# EAGLE design sub (EAGLE 9.6.1)
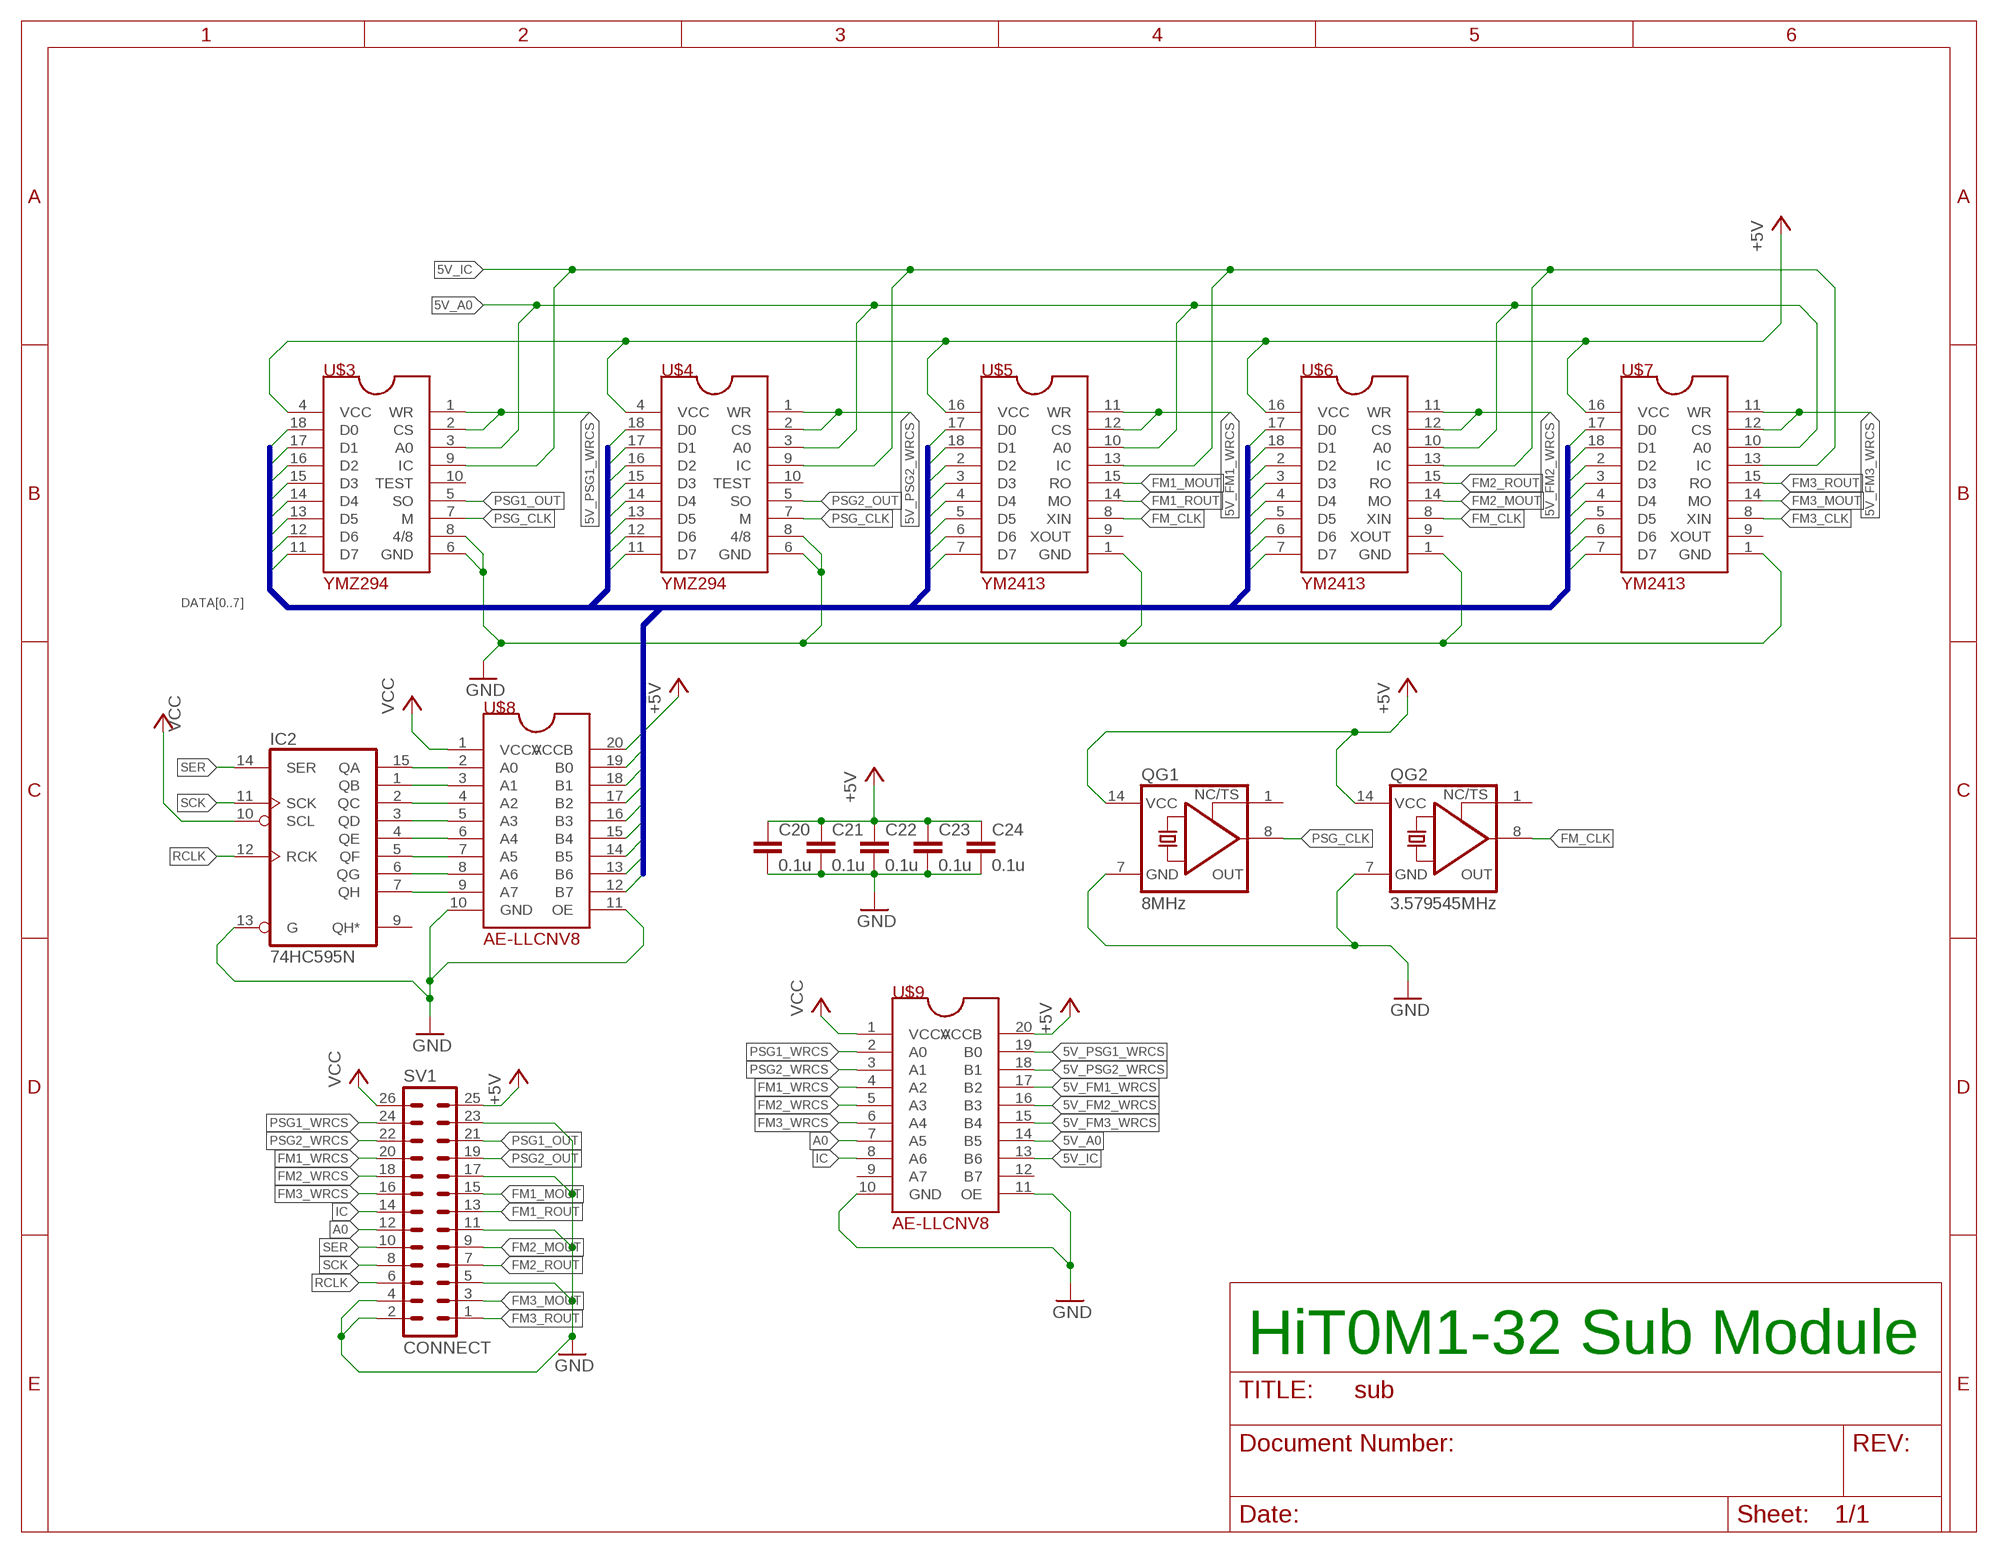
[diagram p0: schematic, sheet 1]

## Parts
C20  0.1u  C-EU025-025X050  [C025-025X050]
C21  0.1u  C-EU025-025X050  [C025-025X050]
C22  0.1u  C-EU025-025X050  [C025-025X050]
C23  0.1u  C-EU025-025X050  [C025-025X050]
C24  0.1u  C-EU025-025X050  [C025-025X050]
IC2  74HC595N  [DIL16]
QG1  8MHz  XO-14  [DIL14S]
QG2  3.579545MHz  XO-14  [DIL14S]
SV1  CONNECT  MA13-2  [MA13-2]
U$3  YMZ294  YMZ294YMZ294  [DIL18]
U$4  YMZ294  YMZ294YMZ294  [DIL18]
U$5  YM2413  [DIL18]
U$6  YM2413  [DIL18]
U$7  YM2413  [DIL18]
U$8  AE-LLCNV8  AE-LLCNV8AE-LLCNV8  [DIL20]
U$9  AE-LLCNV8  AE-LLCNV8AE-LLCNV8  [DIL20]

## Nets
5V_A0: U$3.3(A0) U$4.3(A0) U$5.10(A0) U$6.10(A0) U$7.10(A0) U$9.14(B5)
5V_FM1_WRCS: U$5.11(WR) U$5.12(CS) U$9.17(B2)
5V_FM2_WRCS: U$6.11(WR) U$6.12(CS) U$9.16(B3)
5V_FM3_WRCS: U$7.11(WR) U$7.12(CS) U$9.15(B4)
5V_IC: U$3.9(IC) U$4.9(IC) U$5.13(IC) U$6.13(IC) U$7.13(IC) U$9.13(B6)
5V_PSG1_WRCS: U$3.1(WR) U$3.2(CS) U$9.19(B0)
5V_PSG2_WRCS: U$4.1(WR) U$4.2(CS) U$9.18(B1)
+5V: C20.1 C21.1 C22.1 C23.1 C24.1 QG1.14(VCC) QG2.14(VCC) SV1.25 U$3.4(VCC) U$4.4(VCC) U$5.16(VCC) U$6.16(VCC) U$7.16(VCC) U$8.20(VCCB) U$9.20(VCCB)
A0: SV1.12 U$9.7(A5)
DATA0: U$3.18(D0) U$4.18(D0) U$5.17(D0) U$6.17(D0) U$7.17(D0) U$8.19(B0)
DATA1: U$3.17(D1) U$4.17(D1) U$5.18(D1) U$6.18(D1) U$7.18(D1) U$8.18(B1)
DATA2: U$3.16(D2) U$4.16(D2) U$5.2(D2) U$6.2(D2) U$7.2(D2) U$8.17(B2)
DATA3: U$3.15(D3) U$4.15(D3) U$5.3(D3) U$6.3(D3) U$7.3(D3) U$8.16(B3)
DATA4: U$3.14(D4) U$4.14(D4) U$5.4(D4) U$6.4(D4) U$7.4(D4) U$8.15(B4)
DATA5: U$3.13(D5) U$4.13(D5) U$5.5(D5) U$6.5(D5) U$7.5(D5) U$8.14(B5)
DATA6: U$3.12(D6) U$4.12(D6) U$5.6(D6) U$6.6(D6) U$7.6(D6) U$8.13(B6)
DATA7: U$3.11(D7) U$4.11(D7) U$5.7(D7) U$6.7(D7) U$7.7(D7) U$8.12(B7)
FM1_MOUT: SV1.15 U$5.15(RO)
FM1_ROUT: SV1.13 U$5.14(MO)
FM1_WRCS: SV1.20 U$9.4(A2)
FM2_MOUT: SV1.9 U$6.14(MO)
FM2_ROUT: SV1.7 U$6.15(RO)
FM2_WRCS: SV1.18 U$9.5(A3)
FM3_CLK: U$7.8(XIN)
FM3_MOUT: SV1.3 U$7.14(MO)
FM3_ROUT: SV1.1 U$7.15(RO)
FM3_WRCS: SV1.16 U$9.6(A4)
FM_CLK: QG2.8(OUT) U$5.8(XIN) U$6.8(XIN)
GND: C20.2 C21.2 C22.2 C23.2 C24.2 IC2.13(G) QG1.7(GND) QG2.7(GND) SV1.2 SV1.4 SV1.5 SV1.11 SV1.17 SV1.23 U$3.6(GND) U$3.8(4/8) U$4.6(GND) U$4.8(4/8) U$5.1(GND) U$6.1(GND) U$7.1(GND) U$8.10(GND) U$8.11(OE) U$9.10(GND) U$9.11(OE)
IC: SV1.14 U$9.8(A6)
N$2: IC2.15(QA) U$8.2(A0)
N$14: IC2.1(QB) U$8.3(A1)
N$17: IC2.2(QC) U$8.4(A2)
N$22: IC2.4(QE) U$8.6(A4)
N$27: IC2.3(QD) U$8.5(A3)
N$32: IC2.5(QF) U$8.7(A5)
N$37: IC2.6(QG) U$8.8(A6)
N$42: IC2.7(QH) U$8.9(A7)
PSG1_OUT: SV1.21 U$3.5(SO)
PSG1_WRCS: SV1.24 U$9.2(A0)
PSG2_OUT: SV1.19 U$4.5(SO)
PSG2_WRCS: SV1.22 U$9.3(A1)
PSG_CLK: QG1.8(OUT) U$3.7(M) U$4.7(M)
RCLK: IC2.12(RCK) SV1.6
SCK: IC2.11(SCK) SV1.8
SER: IC2.14(SER) SV1.10
VCC: IC2.10(SCL) SV1.26 U$8.1(VCCA) U$9.1(VCCA)
Unconnected: IC2.9(QH*) QG1.1(TS) QG2.1(TS) U$3.10(TEST) U$4.10(TEST) U$5.9(XOUT) U$6.9(XOUT) U$7.9(XOUT) U$9.9(A7) U$9.12(B7)

## Buses
DATA[0..7]

## Notes on the sheet
- HiT0M1-32 Sub Module

## Power pins joined to a net without a drawn wire
GND: IC2.8(GND)
VCC: IC2.16(VCC)

## Library data of the parts
C20-C24 = rcl:C-EU: CAPACITOR, European symbol; SPICEPREFIX: C
IC2 = 74xx-eu:74*595: 8-bit SHIFT REGISTER, output latch
QG1 QG2 = crystal:XO-: CRYSTAL; OC_FARNELL: unknown; OC_NEWARK: unknown
SV1 = con-lstb:MA13-2: PIN HEADER; OC_FARNELL: unknown; OC_NEWARK: unknown
U$3 U$4 = midi:YMZ294
U$5-U$7 = midi:YM2413
U$8 U$9 = midi:AE-LLCNV8

## Net classes
0 default: width 0.889 mm, clearance 0.254 mm

## Board
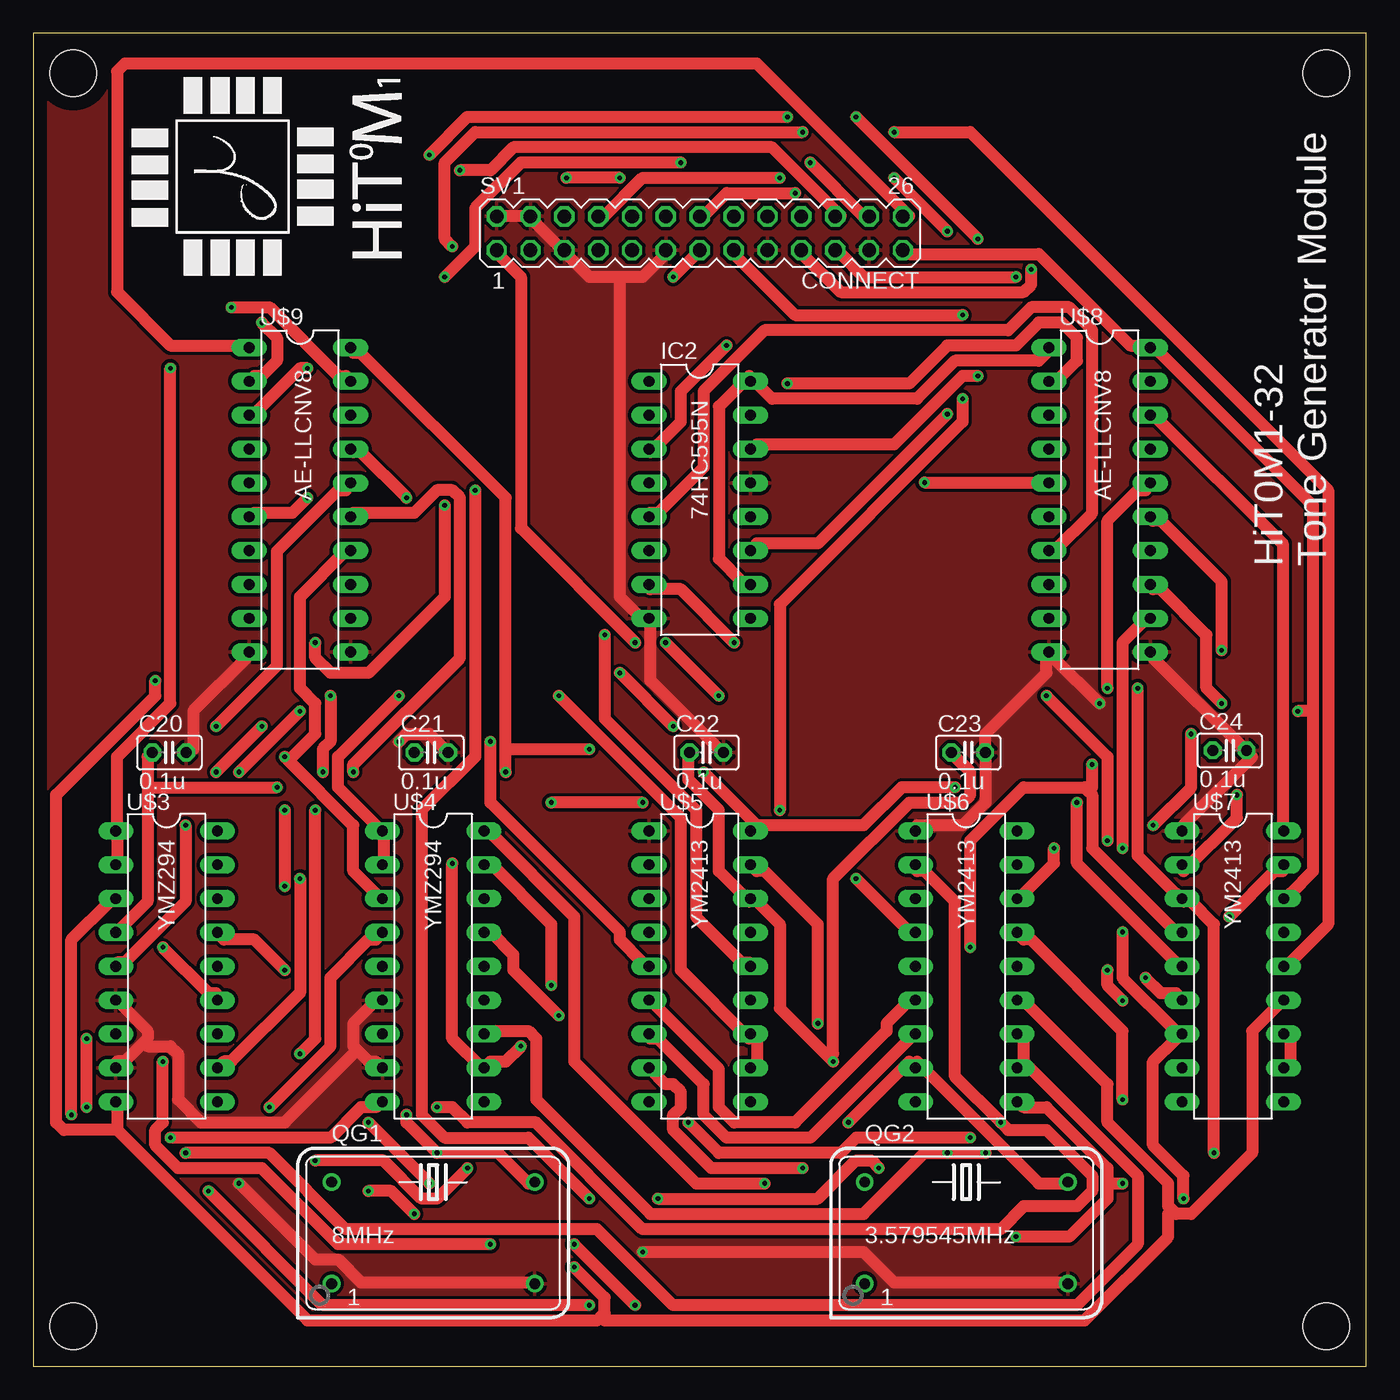
[diagram p1: board, top side]
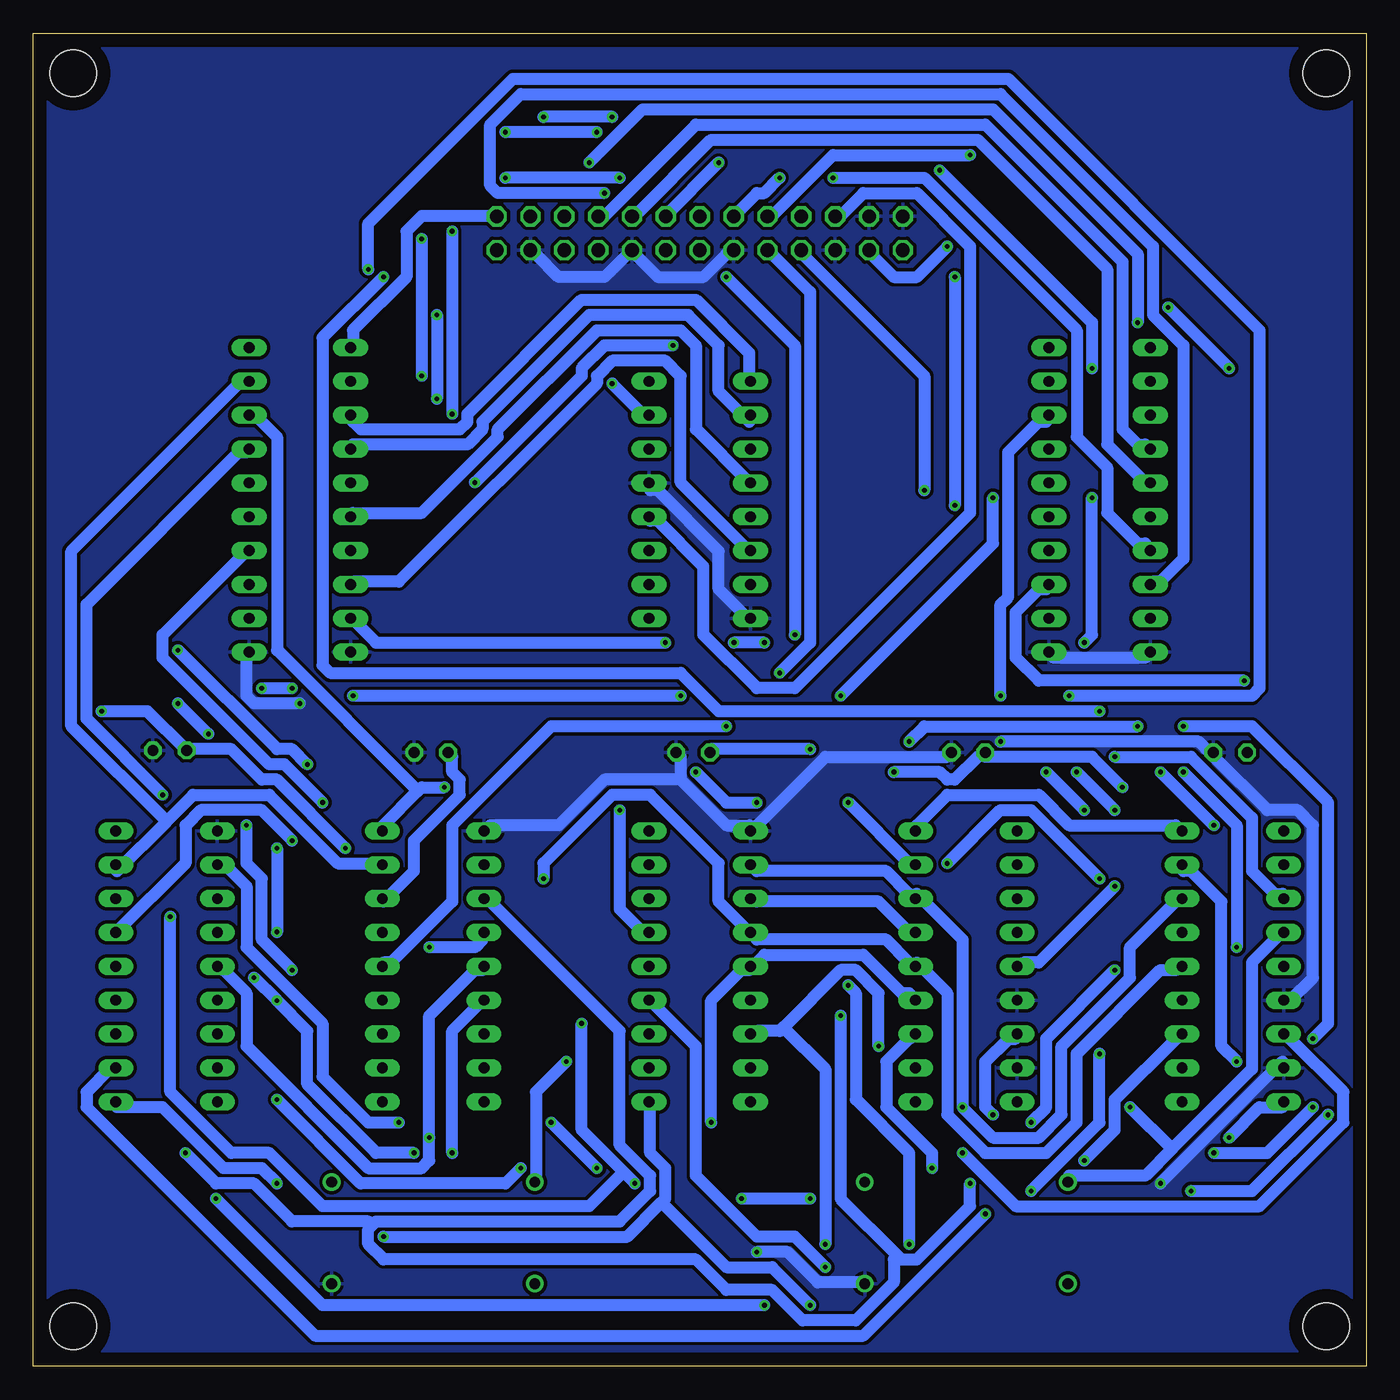
[diagram p2: board, bottom side, seen from below]

Size 100 x 100 mm. Coordinates in mm from the lower left corner, seen from the top.
Outline: 0,0 100,0 100,100 0,100 0,0
Copper layers (1*16): Top 0.035mm / dielectric 1.5mm / Bottom 0.035mm
Design rules "default": minimum track width 6mil, minimum drill 0.35mm, track to track 6mil, track to pad 6mil, pad to pad 6mil, via to via 6mil, smd to smd 6mil, copper to edge 40mil, drill to drill 6mil, minimum pad ring 10mil, minimum via ring 8mil, stop-mask expansion 4mil, vias tented up to drill 0mil, thermal gap 10mil
Holes 3.5 mm at 3,97 3,3 97,3 97,97

### Footprints (pad centres in the part's own frame; a part is rotated, then mirrored left to right if it is on the bottom)
C025-025X050 = drill 0.813 octagon: 1 -1.27,0; 2 1.27,0
DIL16 = drill 0.813 long: 1 -8.89,-3.81; 2 -6.35,-3.81; 3 -3.81,-3.81; 4 -1.27,-3.81; 5 1.27,-3.81; 6 3.81,-3.81; 7 6.35,-3.81; 8 8.89,-3.81; 9 8.89,3.81; 10 6.35,3.81; 11 3.81,3.81; 12 1.27,3.81; 13 -1.27,3.81; 14 -3.81,3.81; 15 -6.35,3.81; 16 -8.89,3.81
DIL14S = drill 0.813: 1 -7.62,-3.81; 7 7.62,-3.81; 8 7.62,3.81; 14 -7.62,3.81
MA13-2 = drill 1.016 octagon: 1 -15.24,-1.27; 2 -15.24,1.27; 3 -12.7,-1.27; 4 -12.7,1.27; 5 -10.16,-1.27; 6 -10.16,1.27; 7 -7.62,-1.27; 8 -7.62,1.27; 9 -5.08,-1.27; 10 -5.08,1.27; 11 -2.54,-1.27; 12 -2.54,1.27; 13 0,-1.27; 14 0,1.27; 15 2.54,-1.27; 16 2.54,1.27; 17 5.08,-1.27; 18 5.08,1.27; 19 7.62,-1.27; 20 7.62,1.27; 21 10.16,-1.27; 22 10.16,1.27; 23 12.7,-1.27; 24 12.7,1.27; 25 15.24,-1.27; 26 15.24,1.27
DIL18 = drill 0.813 long: 1 -10.16,-3.81; 2 -7.62,-3.81; 3 -5.08,-3.81; 4 -2.54,-3.81; 5 0,-3.81; 6 2.54,-3.81; 7 5.08,-3.81; 8 7.62,-3.81; 9 10.16,-3.81; 10 10.16,3.81; 11 7.62,3.81; 12 5.08,3.81; 13 2.54,3.81; 14 0,3.81; 15 -2.54,3.81; 16 -5.08,3.81; 17 -7.62,3.81; 18 -10.16,3.81
DIL20 = drill 0.813 long: 1 -11.43,-3.81; 2 -8.89,-3.81; 3 -6.35,-3.81; 4 -3.81,-3.81; 5 -1.27,-3.81; 6 1.27,-3.81; 7 3.81,-3.81; 8 6.35,-3.81; 9 8.89,-3.81; 10 11.43,-3.81; 11 11.43,3.81; 12 8.89,3.81; 13 6.35,3.81; 14 3.81,3.81; 15 1.27,3.81; 16 -1.27,3.81; 17 -3.81,3.81; 18 -6.35,3.81; 19 -8.89,3.81; 20 -11.43,3.81

### Placement (x,y rotation side)
C20  10.2,46.04 0 top
C21  29.85,46.04 0 top
C22  50.5,46.04 0 top
C23  70.15,46.04 0 top
C24  89.76,46.2 0 top
IC2  50,65 270 top
QG1  30,10 0 top
QG2  70,10 0 top
SV1  50,85 0 top
U$3  10,30 270 top
U$4  30,30 270 top
U$5  50,30 270 top
U$6  70,30 270 top
U$7  90,30 270 top
U$8  80,65 270 top
U$9  20,65 270 top

### Tracks (layer width: path | path; a pad name or v marks a point on that pad's centre or on a via)
5V_A0  (via drill 0.35)
  Top 0.889: 19.14,45.43 24,40.58 24,37.15 25.72,35.43 U$4.3 | 19.14,45.43 v18.86,45.72 | 19.14,45.43 21.14,47.43 21.14,49.72 20,50.86 20,57.72 23.43,61.15 U$9.14 | v73.72,9.72 77.72,9.72 80.58,12.57 80.58,13.72 | 80.58,13.72 80.58,14.86 76.01,19.43 74.3,19.43 U$6.10 | 80.58,13.72 v81.72,13.72 | v2.86,18.86 2.86,32 5.71,34.86 U$3.3 | v13.14,13.14 21.72,4.57 v41.72,4.57
  Bottom 0.889: v18.86,45.72 13.14,45.72 8.57,41.15 8.57,37.15 6.86,35.43 6.29,35.43 U$3.3 | 52.86,12.29 55.44,9.72 v73.72,9.72 | 52.86,12.29 52.58,12.57 52.58,14.86 53.72,16 53.72,19.43 U$5.10 | v81.72,13.72 82.87,14.86 85.72,14.86 90.3,19.43 93.73,19.43 U$7.10 | v2.86,18.86 8.57,13.14 v13.14,13.14 | v41.72,4.57 44.58,7.43 48.01,7.43 52.86,12.29
5V_FM1_WRCS  (via drill 0.35)
  Top 0.889: U$5.11 54.29,22.86 54.29,24.57 U$5.12 53.72,24.57 48.58,29.72 48.58,41.15 v39.43,50.29 | v28,65.15 24.57,68.58 24,68.58 U$9.17
  Bottom 0.889: v28,65.15 28,61.72 v39.43,50.29
5V_FM2_WRCS  (via drill 0.35)
  Top 0.889: 74.3,22.86 74.3,24.57 U$6.12 | v13.72,48.01 18.29,52.58 18.29,61.15 22.86,65.72 23.43,65.72 U$9.16 | v4,19.43 v4,24.57 | v11.43,16 17.72,16 23.43,10.29 42.29,10.29 48.01,4.57 78.3,4.57 82.87,9.14 82.87,14.29 74.3,22.86 | 74.3,22.86 U$6.11
  Bottom 0.889: v13.72,48.01 8.57,48.01 2.86,42.29 2.86,25.72 v4,24.57 | v4,19.43 7.43,16 v11.43,16
5V_FM3_WRCS  (via drill 0.35)
  Top 0.889: U$7.11 94.3,22.86 94.3,24.57 U$7.12 | v24,44.58 24,45.15 32,53.15 32,65.15 31.43,65.72 30.29,65.72 28.57,64.01 24,64.01 U$9.15 | v21.14,41.72 21.14,24.57 v20,23.43 | v25.15,13.14 26.86,13.14 v28.57,11.43
  Bottom 0.889: v21.14,41.72 v24,44.58 | v20,23.43 20,18.29 v25.15,13.14 | v28.57,11.43 37.72,2.29 78.87,2.29 96.01,19.43 96.01,20.57 94.3,22.29 U$7.11
5V_IC  (via drill 0.35)
  Top 0.889: 85.44,11.72 85.72,11.43 86.87,11.43 91.44,16 91.44,25.15 93.73,27.43 U$7.13 | 85.44,11.72 85.15,12 85.15,13.72 80.58,18.29 80.58,21.14 74.3,27.43 U$6.13 | v10.29,17.14 22.29,17.14 24.57,19.43 25.72,19.43 U$4.9 | v40.58,7.43 42.86,5.14 42.86,4 42.58,3.71 | 42.58,3.71 42.29,3.43 20.57,3.43 6.29,17.72 | 6.29,17.72 6.29,19.43 U$3.9 | v9.14,51.44 9.14,50.29 1.71,42.86 1.71,18.29 2.29,17.72 6.29,17.72 | 85.44,11.72 85.15,11.43 85.15,9.72 78.87,3.43 42.86,3.43 42.58,3.71
  Bottom 0.889: v10.29,17.14 8,19.43 6.29,19.43 U$3.9 | v40.58,7.43 42.86,9.72 45.72,9.72 50.29,14.29 50.29,24 53.72,27.43 U$5.13 | v9.14,51.44 24.57,51.44 26.29,53.15 26.29,56.58 24.57,58.29 24,58.29 U$9.13
5V_PSG1_WRCS  (via drill 0.35)
  Top 0.889: U$3.2 6.29,37.72 6.29,40.01 U$3.1 6.29,40.58 6.29,45.72 10.29,49.72 v10.29,74.87 | v14.86,79.44 17.72,79.44 22.86,74.3 23.43,74.3 U$9.19
  Bottom 0.889: v10.29,74.87 v14.86,79.44
5V_PSG2_WRCS  (via drill 0.35)
  Top 0.889: U$4.2 26.29,37.72 26.29,40.01 U$4.1 25.72,40.58 22.86,43.43 22.86,45.72 v27.43,50.29
  Bottom 0.889: v27.43,50.29 27.43,57.15 26.86,57.72 26.86,68.58 24.57,70.87 24,70.87 U$9.18
+5V  (via drill 0.35)
  Top 0.889: SV1.25 65.72,83.44 75.44,83.44 82.3,76.58 83.44,76.58 U$8.20 84.01,76.58 96.01,64.58 96.01,49.15 | 96.01,49.15 96.01,37.15 94.3,35.43 U$7.16 | 96.01,49.15 v94.87,49.15 | C22.1 49.15,45.72 49.15,44.01 51.44,41.72 51.44,37.15 53.72,34.86 U$5.16 54.29,34.86 56.01,33.15 56.01,26.86 59.72,23.15 | 59.72,23.15 v60.01,22.86 | C23.1 69.15,45.72 70.29,44.58 70.29,42.86 69.72,42.29 65.72,42.29 60.01,36.58 60.01,23.43 59.72,23.15 | 8.57,43.43 8.57,45.72 C20.1 | 8.57,43.43 8.57,34.86 6.29,32.58 U$3.4 | v17.72,19.43 22.29,24 22.29,29.15 25.15,32 25.72,32 U$4.4 | 8.57,43.43 v18.29,43.43 | v35.43,44.58 35.43,46.29 | 35.43,46.29 35.43,65.15 24.57,76.01 24,76.01 U$9.20 | 35.43,46.29 v41.72,46.29 | v76.58,38.86 76.58,37.72 74.3,35.43 U$6.16
  Bottom 0.889: v94.87,49.15 91.44,49.15 88.58,46.29 C24.1 88.01,46.29 85.15,46.29 82.87,44.01 81.72,44.01 v76.58,38.86 | C23.1 68.58,45.72 68.58,44.58 68.01,44.01 68.01,42.86 71.44,39.43 71.44,37.15 73.72,34.86 U$6.16 | v60.01,22.86 62.29,20.57 62.29,14.29 QG2.14 | 14.57,16.29 8.57,22.29 8.57,30.29 6.29,32.58 U$3.4 | 14.57,16.29 16.57,14.29 22.29,14.29 QG1.14 | 14.57,16.29 v17.72,19.43 | v18.29,43.43 20.57,45.72 28.57,45.72 C21.1 29.15,45.72 30.86,44.01 31.43,44.01 32,44.58 v35.43,44.58 | v41.72,46.29 49.15,46.29 C22.1
A0  (via drill 0.35)
  Top 0.889: v44.01,89.15 v40.01,89.15
  Bottom 0.889: v40.01,89.15 33.15,89.15 21.72,77.72 21.72,69.72 19.43,67.44 19.43,64.01 17.14,61.72 16.57,61.72 U$9.7 | v44.01,89.15 45.15,88.01 45.72,88.01 47.43,86.3 SV1.12
DATA0  (via drill 0.35)
  Top 0.889: v58.86,25.72 58.86,33.15 54.86,37.15 54.29,37.15 U$5.17 | v54.86,13.72 49.72,13.72 40.58,22.86 40.58,33.72 34.29,40.01 U$4.18 | v89.72,33.72 93.15,37.15 93.73,37.15 U$7.17
  Bottom 0.889: 90.01,40.86 93.73,37.15 U$7.17 | 90.01,40.86 88.01,42.86 82.3,42.86 77.15,37.72 74.3,37.72 U$6.17 | 90.01,40.86 97.16,48.01 97.16,61.15 84.58,73.72 84.01,73.72 U$8.19 | v58.86,25.72 58.86,17.72 55.72,14.57 | v54.86,13.72 55.72,14.57 | U$3.18 14.29,40.58 22.29,40.58 24.57,42.86 31.43,42.86 33.72,40.58 U$4.18 | v89.72,33.72 89.72,20.57 85.15,16 82.3,16 78.3,12 58.29,12 55.72,14.57
DATA1  (via drill 0.35)
  Top 0.889: v9.72,22.86 9.72,18.29 9.14,17.72 9.14,16.57 10.86,14.86 17.14,14.86 22.86,9.14 v34.29,9.14 | v38.86,28.57 38.86,33.15 34.29,37.72 U$4.17 | 54.29,40.58 62.29,40.58 65.15,43.43 v69.15,43.43 | U$7.18 93.73,40.58 93.73,61.72 84.01,71.44 U$8.18 | v45.72,42.29 v38.86,42.29 | 54.29,40.58 v50.29,44.58 | 54.29,40.58 U$5.18
  Bottom 0.889: v9.72,22.86 10.86,24 10.86,34.86 13.14,37.15 13.72,37.15 U$3.17 | v34.29,9.14 34.29,16 38.29,20 38.29,28 v38.86,28.57 | v69.15,43.43 70.87,43.43 71.15,43.15 | 71.15,43.15 73.72,40.58 U$6.18 | 71.15,43.15 81.72,53.72 81.72,69.72 83.44,71.44 U$8.18 | v38.86,42.29 34.29,37.72 U$4.17 | v45.72,42.29 48.01,42.29 v50.29,44.58
DATA2  (via drill 0.35)
  Top 0.889: U$6.2 66.29,37.15 66.86,37.15 69.15,34.86 69.15,21.72 v72.58,18.29 73.15,17.72 76.01,17.72 79.44,14.29 79.44,13.14 78.3,12 74.3,12 72.58,10.29 45.72,10.29 37.72,18.29 32.58,18.29 31.43,19.43 v30.29,19.43 | v90.3,42.86 90.3,41.15 86.3,37.15 U$7.2
  Bottom 0.889: U$3.16 14.29,34.86 17.72,31.43 17.72,29.15 22.86,24 22.86,18.86 24.57,17.14 28,17.14 v30.29,19.43 30.29,32 33.72,35.43 U$4.16 34.29,35.43 36.01,37.15 45.72,37.15 U$5.2 | v72.58,18.29 74.87,18.29 78.3,21.72 78.3,25.72 84.01,31.43 84.01,36.01 85.72,37.72 U$7.2 | v90.3,42.86 96.01,48.58 96.01,57.15 84.58,68.58 84.01,68.58 U$8.17
DATA3  (via drill 0.35)
  Top 0.889: v18.86,29.72 16.57,32 14.29,32 U$3.15 | v29.72,13.72 v25.15,18.29 | v39.43,26.29 36.01,29.72 36.01,30.86 34.29,32.58 U$4.15 | v88.58,16 88.58,33.15 86.87,34.86 86.3,34.86 U$7.3 85.72,35.43 82.87,38.29 v82.87,50.86 | v80.58,50.86 80.58,63.44 82.87,65.72 83.44,65.72 U$8.16
  Bottom 0.889: v18.86,29.72 24,24.57 24,19.43 v25.15,18.29 | v29.72,13.72 29.72,12 33.72,8 34.86,8 35.15,8.29 | 35.15,8.29 39.43,12.57 v39.43,26.29 | U$5.3 45.72,34.86 36.58,34.86 34.29,32.58 U$4.15 | 74.58,10.57 74.87,10.29 74.87,9.14 73.72,8 50.29,8 48.01,5.71 44.58,5.71 42.29,3.43 38.29,3.43 35.43,6.29 35.43,8 35.15,8.29 | 74.58,10.57 74.3,10.86 56.01,10.86 53.72,13.14 53.72,14.29 56.01,16.57 56.01,25.15 65.72,34.86 U$6.3 | v88.58,16 86.3,13.72 83.44,13.72 80.58,10.86 74.87,10.86 74.58,10.57 | v82.87,50.86 v80.58,50.86
DATA4  (via drill 0.35)
  Top 0.889: v61.72,36.58 65.72,32.58 U$6.4 | 79.15,43.15 78.87,43.43 74.3,43.43 70.29,39.43 v70.29,31.43 | 79.15,43.15 79.44,42.86 79.44,38.86 85.72,32.58 U$7.4 | v89.15,53.72 89.15,58.86 84.58,63.44 84.01,63.44 U$8.15 | v79.44,45.15 79.44,43.43 79.15,43.15
  Bottom 0.889: U$3.14 14.29,29.72 15.43,29.72 21.72,23.43 21.72,18.29 24,16 28.57,16 31.43,18.86 31.43,28 33.72,30.29 U$4.14 34.29,30.29 36.01,32 45.72,32 U$5.4 46.29,32.58 48.58,34.86 48.58,37.72 53.72,42.86 56.58,42.86 61.72,37.72 v61.72,36.58 | v70.29,31.43 66.86,31.43 66.29,32 U$6.4 | v89.15,53.72 81.72,46.29 80.58,46.29 v79.44,45.15
DATA5  (via drill 0.35)
  Top 0.889: v9.72,31.43 13.14,28 13.72,28 U$3.13 | v17.14,48.01 v13.72,44.58 | v34.29,46.86 34.29,42.29 44.01,32.58 44.01,32 45.72,30.29 U$5.5 | v78.3,42.29 78.3,37.72 85.72,30.29 U$7.5 | v49.15,18.29 51.44,16 60.58,16 61.72,17.14 v70.29,17.14
  Bottom 0.889: v9.72,31.43 9.72,40.58 v13.72,44.58 | v17.14,48.01 33.15,48.01 v34.29,46.86 | U$4.13 34.29,28 34.86,28 37.72,30.86 45.15,30.86 45.72,30.29 U$5.5 46.29,29.72 46.86,29.72 49.15,27.43 v49.15,18.29 | U$6.5 66.29,29.72 66.86,29.72 70.29,26.29 v70.29,17.14 70.29,15.43 70.87,14.86 74.87,14.86 84.01,24 84.01,28 85.72,29.72 U$7.5 | v78.3,42.29 81.15,45.15 82.3,45.15 90.3,53.15 90.3,54.86 84.01,61.15 U$8.14
DATA6  (via drill 0.35)
  Top 0.889: U$5.6 46.29,27.43 51.44,22.29 51.44,19.43 52.58,18.29 57.15,18.29 64.01,25.15 64.01,25.72 65.72,27.43 U$6.6 | v21.14,15.43 26.29,15.43 29.15,12.57 30.29,12.57 v32.58,14.86 | v83.44,29.15 84.58,28 85.72,28 U$7.6 | v71.44,16 v68.58,16 66.86,16 62.29,11.43 46.29,11.43 37.72,20 37.72,24.57 37.15,25.15 34.29,25.15 U$4.12 | v89.15,49.72 88.01,50.86 88.01,54.86 84.58,58.29 84.01,58.29 U$8.13 | v86.87,47.43 86.87,43.43 v84.01,40.58 | v80.58,29.72 80.58,28.57 v81.72,27.43
  Bottom 0.889: v21.14,15.43 18.86,17.72 18.86,20 14.29,24.57 U$3.12 | v32.58,14.86 32.58,16 36.01,19.43 36.01,22.86 34.29,24.57 U$4.12 | v83.44,29.15 v81.72,27.43 79.44,25.15 79.44,21.14 74.3,16 v71.44,16 | v86.87,47.43 v89.15,49.72 | v84.01,40.58 84.01,37.72 82.87,36.58 82.87,32 v80.58,29.72 | v68.58,16 68.58,25.15 66.29,27.43 U$6.6
DATA7  (via drill 0.35)
  Top 0.889: v81.72,32.58 81.72,29.15 85.72,25.15 U$7.7 85.72,24.57 84.01,22.86 84.01,16.57 86.3,14.29 v86.3,12.57 | v81.72,38.86 81.72,54.29 83.44,56.01 U$8.12 | U$5.7 46.29,24.57 46.86,24.57 50.29,21.14 50.29,18.86 52.01,17.14 58.29,17.14 65.72,24.57 U$6.7 | v20,36.58 20,28 14.86,22.86 14.29,22.86 U$3.11 | v31.43,37.72 31.43,24.57 33.72,22.29 U$4.11 34.29,22.86 35.43,22.86 v36.58,24 | v40.58,9.14 v45.15,4.57
  Bottom 0.889: v81.72,38.86 v81.72,32.58 | v20,36.58 25.15,41.72 27.43,41.72 v31.43,37.72 | 43.72,25.43 39.43,29.72 38.29,29.72 36.58,28 v36.58,24 | 43.72,25.43 44.01,25.15 45.72,25.15 U$5.7 | v86.3,12.57 78.3,4.57 v45.15,4.57 | v40.58,9.14 40.58,22.29 43.72,25.43
FM1_MOUT  (via drill 0.35)
  Top 0.889: v56.01,41.72 56.01,57.15 69.72,70.87 v69.72,72.58 | v69.72,78.87 57.15,78.87 52.58,83.44 SV1.15
  Bottom 0.889: v56.01,41.72 56.01,34.29 54.29,32.58 U$5.15 | v69.72,78.87 v69.72,72.58
FM1_ROUT  (via drill 0.35)
  Top 0.889: v42.86,54.86 42.86,48.58 49.72,41.72 49.72,33.72 53.15,30.29 53.72,30.29 U$5.14 | v48.01,81.72 49.72,83.44 SV1.13
  Bottom 0.889: v42.86,54.86 42.86,76.58 v48.01,81.72
FM1_WRCS
  Bottom 0.889: U$9.4 16.57,69.15 17.14,69.15 18.29,70.29 18.29,82.87 28.57,93.15 50.29,93.15 57.15,86.3 SV1.20
FM2_MOUT  (via drill 0.35)
  Top 0.889: v44.01,52.01 v48.01,48.01
  Bottom 0.889: v48.01,48.01 61.15,48.01 68.58,40.58 68.58,34.86 73.15,30.29 73.72,30.29 U$6.14 | v44.01,52.01 41.72,54.29 41.72,80.58 44.58,83.44 SV1.9
FM2_ROUT  (via drill 0.35)
  Top 0.889: v81.72,20 81.72,25.15 74.87,32 74.3,32 U$6.15 | v63.44,14.86 62.87,15.43 61.72,15.43 58.86,12.57 v46.86,12.57 | v41.72,12.57 37.15,17.14 30.86,17.14 29.15,18.86 29.15,41.72 33.15,45.72 v33.15,65.72
  Bottom 0.889: v81.72,20 75.44,13.72 64.58,13.72 v63.44,14.86 | v41.72,12.57 v46.86,12.57 | v33.15,65.72 33.15,74.3 42.29,83.44 SV1.7
FM2_WRCS
  Bottom 0.889: U$9.5 16.57,66.29 19.43,69.15 19.43,82.3 29.15,92.01 49.15,92.01 54.86,86.3 SV1.18
FM3_MOUT  (via drill 0.35)
  Top 0.889: v64.58,92.58 70.29,92.58 97.16,65.72 97.16,33.15 94.3,30.29 U$7.14 | v57.72,92.58 33.15,92.58 30.86,90.3 30.86,84.58 v31.43,84.01
  Bottom 0.889: v57.72,92.58 v64.58,92.58 | v31.43,84.01 33.72,81.72 35.43,81.72 37.15,83.44 SV1.3
FM3_ROUT  (via drill 0.35)
  Top 0.889: v80.58,39.43 80.58,45.72 v76.01,50.29 | v47.43,54.29 v51.44,50.29 | v45.15,54.29 36.58,62.87 36.58,81.72 34.86,83.44 SV1.1
  Bottom 0.889: v80.58,39.43 82.87,41.72 87.44,41.72 88.58,40.58 88.58,37.72 93.73,32.58 U$7.15 | v51.44,50.29 v76.01,50.29 | v45.15,54.29 v47.43,54.29
FM3_WRCS  (via drill 0.35)
  Top 0.889: v20.57,65.15 19.43,64.01 16.57,64.01 U$9.6 | v21.14,54.29 21.14,53.15 22.29,52.01 25.15,52.01 30.86,57.72 v30.86,64.58 | v30.86,81.72 33.15,84.01 33.15,86.87 36.58,90.3 v48.58,90.3
  Bottom 0.889: v20.57,65.15 20.57,54.86 v21.14,54.29 | v30.86,81.72 v30.86,64.58 | v48.58,90.3 52.58,86.3 SV1.16
FM_CLK  (via drill 0.35)
  Top 0.889: v57.72,14.86 50.86,14.86 48.01,17.72 48.01,18.86 48.58,19.43 48.58,20.57 48.01,21.14 47.43,21.14 46.29,22.29 U$5.8 | v61.15,18.29 65.72,22.86 U$6.8 66.29,22.86 75.44,13.72 77.15,13.72 QG2.8
  Bottom 0.889: v61.15,18.29 v57.72,14.86
GND  (via drill 0.35)
  Top 0.889: U$7.1 86.3,40.58 91.44,45.72 C24.2 90.87,46.29 84.01,53.15 U$8.11 | U$6.1 66.29,40.58 69.72,40.58 71.44,42.29 71.44,45.72 C23.2 71.44,46.29 71.44,47.43 76.01,52.01 76.01,53.15 U$8.10 76.58,53.15 v80.01,49.72 | SV1.2 34.86,86.3 37.15,86.3 SV1.4 37.72,85.72 39.43,84.01 SV1.5 40.01,83.44 41.72,81.72 44.01,81.72 | 44.01,81.72 45.72,81.72 47.43,83.44 SV1.11 | C22.2 51.44,46.29 46.29,51.44 46.29,56.01 IC2.8 45.72,56.01 44.01,57.72 44.01,81.72 | C20.2 12,46.29 12,49.15 16,53.15 U$9.10 | 24.29,23.72 24,24 24,25.72 25.72,27.43 U$4.6 | 24.29,23.72 25.15,22.86 25.72,22.86 U$4.8 | 8.29,24.29 8.57,24.57 8.57,25.15 6.29,27.43 U$3.6 | 8.29,24.29 6.86,22.86 6.29,22.86 U$3.8 | v15.43,13.72 21.14,8 22.86,8 24.57,6.29 37.15,6.29 QG1.7 | v45.72,8.57 62.29,8.57 64.58,6.29 77.15,6.29 QG2.7 | 24.29,23.72 18.86,18.29 12.57,18.29 10.86,20 10.86,23.43 10.29,24 8.57,24 8.29,24.29 | v27.43,46.86 28,47.43 29.72,47.43 30.86,46.29 C21.2
  Bottom 0.889: v80.01,49.72 83.44,49.72 84.01,50.29 84.01,53.15 U$8.11 | SV1.11 48.01,83.44 49.72,81.72 53.15,81.72 54.86,83.44 SV1.17 55.44,83.44 57.15,81.72 60.58,81.72 62.29,83.44 SV1.23 | 51.44,44.01 48.01,40.58 46.29,40.58 U$5.1 45.72,40.58 40.58,45.72 31.43,45.72 C21.2 | 51.44,44.01 51.44,45.72 C22.2 | IC2.13 53.72,65.72 53.15,65.72 48.58,61.15 48.58,58.29 46.29,56.01 IC2.8 | 51.44,44.01 57.15,44.01 60.58,40.58 65.72,40.58 U$6.1 | U$9.11 23.43,53.15 16.57,53.15 U$9.10 | v15.43,13.72 6.29,22.86 U$3.8 | v45.72,8.57 43.43,8.57 41.15,6.29 37.72,6.29 QG1.7 | U$3.6 5.71,27.43 4,29.15 4,40.58 5.14,41.72 7.43,41.72 11.43,45.72 C20.2 12,46.29 12.57,46.86 v27.43,46.86
  pour Top: 0,0 0,100 100,100 100,0
  pour Bottom: 0,0 0,100 100,100 100,0
IC  (via drill 0.35)
  Top 0.889: v57.15,88.01 52.01,88.01 50.29,86.3 SV1.14
  Bottom 0.889: v57.15,88.01 65.15,88.01 65.72,88.58 65.72,93.15 63.44,95.44 27.43,95.44 16,84.01 16,78.87 13.72,76.58 13.72,60.58 15.43,58.86 16,58.86 U$9.8
N$2  (via drill 0.35)
  Top 0.889: v56.58,73.72 65.72,73.72 68.58,76.58 73.72,76.58 75.44,78.3 77.15,78.3 78.3,77.15 78.3,75.44 76.58,73.72 U$8.2
  Bottom 0.889: v56.58,73.72 54.29,71.44 IC2.15
N$14
  Bottom 0.889: IC2.1 46.29,74.3 46.29,76.01 50.29,80.01 58.86,80.01 67.44,71.44 67.44,70.87 68.01,70.29 75.44,70.29 76.01,70.87 U$8.3
N$17
  Bottom 0.889: U$8.4 76.01,69.15 67.44,69.15 66.29,70.29 66.29,70.87 58.29,78.87 50.86,78.87 48.58,76.58 48.58,73.15 46.29,70.87 IC2.2
N$22
  Bottom 0.889: IC2.4 46.29,66.29 50.29,70.29 50.29,76.58 51.44,77.72 57.72,77.72 65.15,70.29 65.15,69.72 70.87,64.01 76.01,64.01 U$8.6
N$27  (via drill 0.35)
  Top 0.889: v66.86,66.29 76.01,66.29 U$8.5 | v52.01,76.58 48.58,73.15 48.58,70.87 46.29,68.58 IC2.3
  Bottom 0.889: v66.86,66.29 58.86,74.3 58.86,74.87 57.15,76.58 v52.01,76.58
N$32
  Top 0.889: IC2.5 46.29,64.01 46.86,64.01 50.29,67.44 50.29,73.15 54.86,77.72 73.15,77.72 74.87,79.44 77.72,79.44 79.44,77.72 79.44,64.01 76.58,61.15 U$8.7
N$37
  Bottom 0.889: U$8.8 76.01,58.86 72.58,58.86 57.72,73.72 57.72,74.3 56.58,75.44 52.58,75.44 51.44,74.3 51.44,66.29 46.29,61.15 IC2.6
N$42  (via drill 0.35)
  Top 0.889: v52.58,54.29 48.58,58.29 46.29,58.29 IC2.7
  Bottom 0.889: v52.58,54.29 74.3,54.29 76.01,56.01 U$8.9
PSG1_OUT  (via drill 0.35)
  Top 0.889: v11.43,40.58 11.43,34.86 6.86,30.29 6.29,30.29 U$3.5 | v20,49.15 v15.43,44.58 | v73.72,81.72 62.29,81.72 60.58,83.44 SV1.21
  Bottom 0.889: v15.43,44.58 v11.43,40.58 | v20,49.15 48.58,49.15 51.44,52.01 77.72,52.01 78.3,52.58 78.3,77.15 v73.72,81.72
PSG1_WRCS  (via drill 0.35)
  Top 0.889: v17.14,78.3 18.29,77.15 18.29,75.44 17.14,74.3 16.57,74.3 U$9.2 | v58.29,90.3 62.29,86.3 SV1.24
  Bottom 0.889: v17.14,78.3 17.14,83.44 28,94.3 54.29,94.3 v58.29,90.3
PSG2_OUT  (via drill 0.35)
  Top 0.889: v18.86,41.72 v18.86,36.01 | v21.72,44.58 21.72,46.29 22.29,46.86 v22.29,50.29 | v74.87,82.3 74.87,81.15 74.3,80.58 60.58,80.58 57.72,83.44 SV1.19
  Bottom 0.889: v18.86,36.01 24.57,30.29 25.72,30.29 U$4.5 | v21.72,44.58 v18.86,41.72 | v22.29,50.29 8.57,50.29 8,50.86 8,77.72 26.86,96.58 64.01,96.58 74.87,85.72 v74.87,82.3
PSG2_WRCS  (via drill 0.35)
  Top 0.889: v20.57,74.87 20,74.87 16.57,71.44 U$9.3 | v32,89.72 34.29,89.72 36.01,91.44 55.44,91.44 60.58,86.3 SV1.22
  Bottom 0.889: v20.57,74.87 20.57,78.3 v32,89.72
PSG_CLK  (via drill 0.35)
  Top 0.889: QG1.8 37.15,13.72 34.86,16 v30.29,16 28,18.29 v28,18.86
  Bottom 0.889: v30.29,16 26.29,12 8,12 1.71,18.29 1.71,20.57 5.71,24.57 U$3.7 | v28,18.86 28.57,19.43 28.57,22.86 26.86,24.57 26.29,24.57 U$4.7
RCLK
  Bottom 0.889: IC2.12 53.72,63.44 53.15,63.44 49.72,60.01 49.72,54.86 45.72,50.86 42.86,50.86 29.72,64.01 29.72,84.01 33.72,88.01 37.72,88.01 39.43,86.3 SV1.6
SCK  (via drill 0.35)
  Top 0.889: v68.58,71.44 58.86,61.72 54.29,61.72 IC2.11 | v64.58,89.15 v68.58,85.15 | v56.01,89.15 45.72,89.15 42.86,86.3 SV1.8
  Bottom 0.889: v68.58,85.15 v68.58,71.44 | v56.01,89.15 v64.58,89.15
SER  (via drill 0.35)
  Top 0.889: v70.87,74.3 69.72,74.3 64.58,69.15 54.29,69.15 IC2.14 | v61.72,93.73 v70.87,84.58 | v56.58,93.73 32.58,93.73 v29.72,90.87
  Bottom 0.889: v70.87,84.58 v70.87,74.3 | v56.58,93.73 v61.72,93.73 | v29.72,90.87 40.01,90.87 44.58,86.3 SV1.10
VCC
  Top 0.889: IC2.10 53.72,58.86 53.15,58.86 51.44,60.58 51.44,72.01 53.72,74.3 IC2.16 54.29,73.72 55.44,72.58 66.29,72.58 69.15,75.44 75.44,75.44 76.01,76.01 U$8.1 | U$9.1 16,76.58 10.29,76.58 6.29,80.58 6.29,97.16 6.86,97.73 54.29,97.73 65.72,86.3 SV1.26
  Bottom 0.889: U$8.1 76.01,76.58 76.01,77.72 72.01,81.72 72.01,85.15 70.87,86.3 65.72,86.3 SV1.26

### Text on the board
tPlace: HiT0M1-32 / Tone Generator Module